# EAGLE design main (EAGLE 7.2.0)
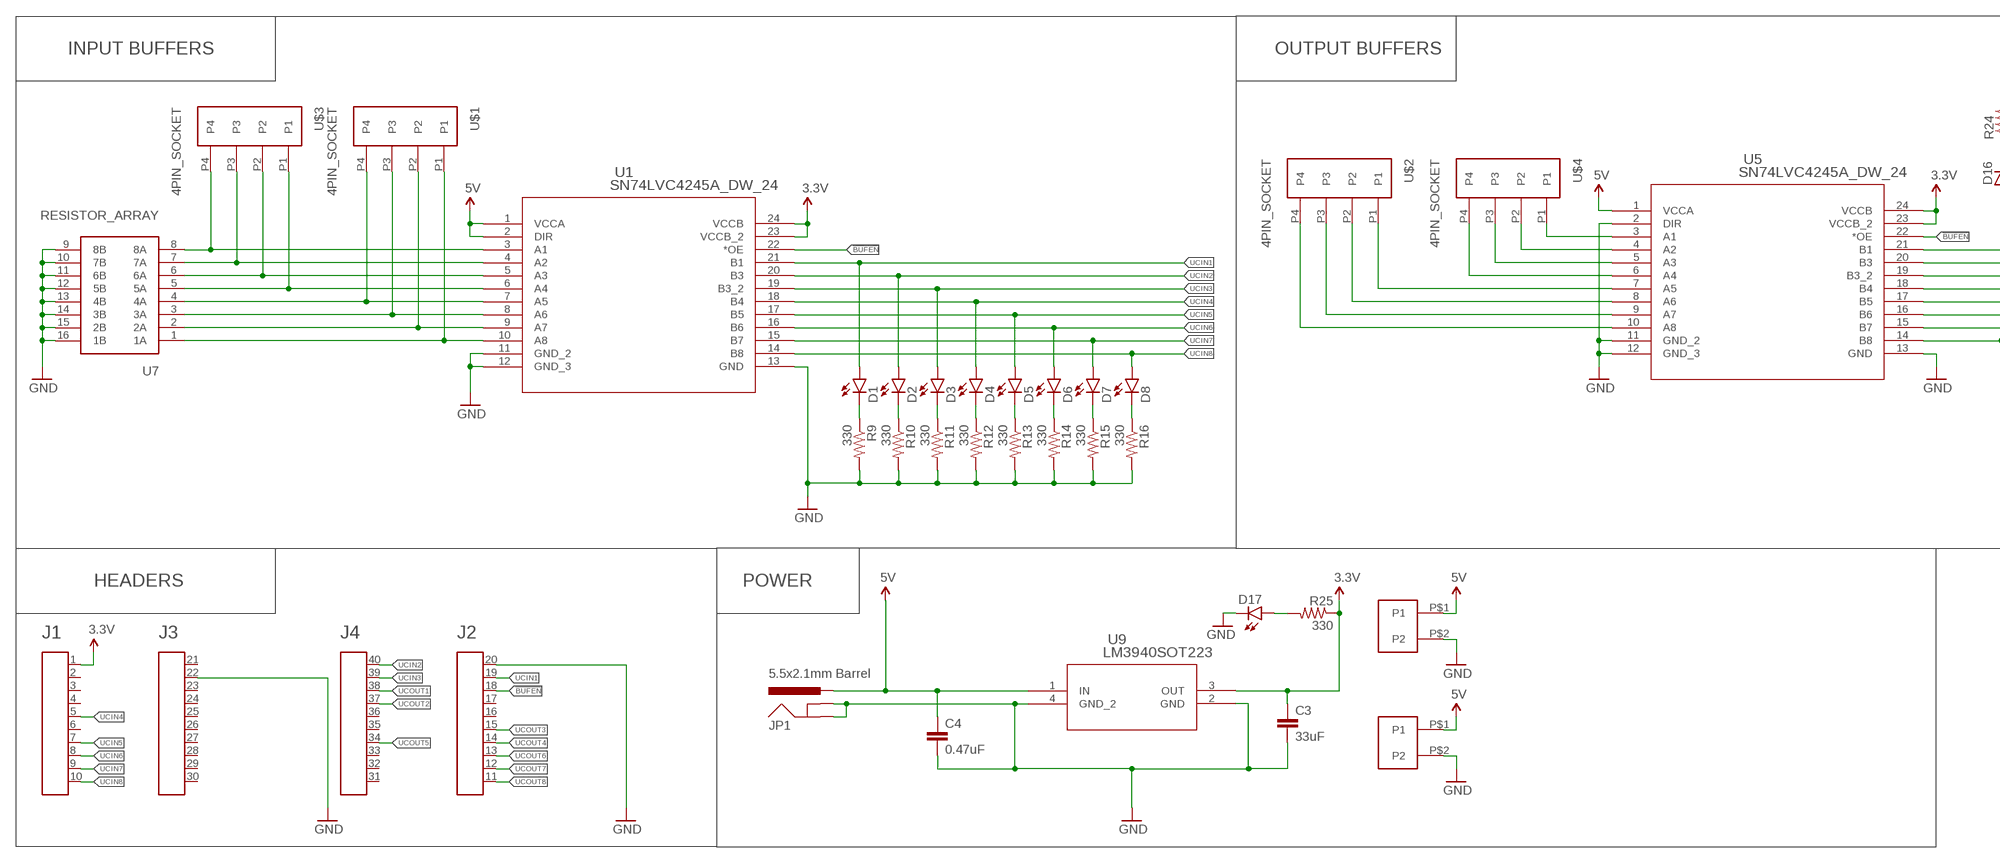
[diagram p0: schematic, sheet 1, part 1 of 2]
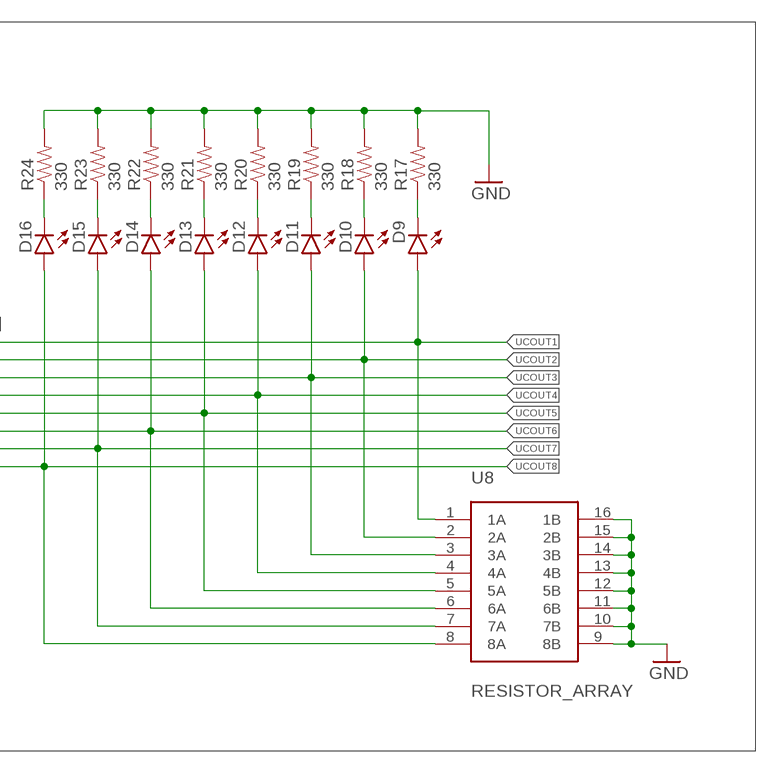
[diagram p1: schematic, sheet 1, part 2 of 2]

## Parts
A1  HEADER4X10-BOOSTERPACK  [4X10-BOOSTERPACK]
C3  33uF  2.2UF50V10%(1206)  [1206]
C4  0.47uF  1.0UF-25V-+80/-20(0805)  [0805]
D1  LED3MM  [LED3MM]
D2  LED3MM  [LED3MM]
D3  LED3MM  [LED3MM]
D4  LED3MM  [LED3MM]
D5  LED3MM  [LED3MM]
D6  LED3MM  [LED3MM]
D7  LED3MM  [LED3MM]
D8  LED3MM  [LED3MM]
D9  LED3MM  [LED3MM]
D10  LED3MM  [LED3MM]
D11  LED3MM  [LED3MM]
D12  LED3MM  [LED3MM]
D13  LED3MM  [LED3MM]
D14  LED3MM  [LED3MM]
D15  LED3MM  [LED3MM]
D16  LED3MM  [LED3MM]
D17  LED3MM  [LED3MM]
JP1  5.5x2.1mm Barrel  POWER_JACKSMD  [POWER_JACK_SMD]
R9  330  RESISTOR0805-RES  [0805]
R10  330  RESISTOR0805-RES  [0805]
R11  330  RESISTOR0805-RES  [0805]
R12  330  RESISTOR0805-RES  [0805]
R13  330  RESISTOR0805-RES  [0805]
R14  330  RESISTOR0805-RES  [0805]
R15  330  RESISTOR0805-RES  [0805]
R16  330  RESISTOR0805-RES  [0805]
R17  330  RESISTOR0805-RES  [0805]
R18  330  RESISTOR0805-RES  [0805]
R19  330  RESISTOR0805-RES  [0805]
R20  330  RESISTOR0805-RES  [0805]
R21  330  RESISTOR0805-RES  [0805]
R22  330  RESISTOR0805-RES  [0805]
R23  330  RESISTOR0805-RES  [0805]
R24  330  RESISTOR0805-RES  [0805]
R25  330  RESISTOR0805-RES  [0805]
U1  SN74LVC4245A_DW_24  [DW24]
U5  SN74LVC4245A_DW_24  [DW24]
U7  RESISTOR_ARRAY  [DIL16]
U8  RESISTOR_ARRAY  [DIL16]
U9  LM3940SOT223  [DCY]
U$1  4PIN_SOCKET  [CONN-4PIN]
U$2  4PIN_SOCKET  [CONN-4PIN]
U$3  4PIN_SOCKET  [CONN-4PIN]
U$4  4PIN_SOCKET  [CONN-4PIN]
U$5  2PIN_SOCKET  [CONN-2PIN]
U$6  2PIN_SOCKET  [CONN-2PIN]

## Nets
3.3V: A1.1 C3.1 R25.1 U1.23(VCCB_2) U1.24(VCCB) U5.23(VCCB_2) U5.24(VCCB) U9.3(OUT)
5V: C4.1 JP1.VIN0(PWR) U1.1(VCCA) U1.2(DIR) U5.1(VCCA) U9.1(IN) U$5.P$1(P1) U$6.P$1(P1)
!BUFEN!: A1.18 U1.22(*OE) U5.22(*OE)
GND: A1.20 A1.22 C3.2 C4.2 D17.K(C) JP1.GND(GNDBREAK) JP1.P$4(GND) R9.2 R10.2 R11.2 R12.2 R13.2 R14.2 R15.2 R16.2 R17.2 R18.2 R19.2 R20.2 R21.2 R22.2 R23.2 R24.2 U1.11(GND_2) U1.12(GND_3) U1.13(GND) U5.2(DIR) U5.11(GND_2) U5.12(GND_3) U5.13(GND) U7.9(8B) U7.10(7B) U7.11(6B) U7.12(5B) U7.13(4B) U7.14(3B) U7.15(2B) U7.16(1B) U8.9(8B) U8.10(7B) U8.11(6B) U8.12(5B) U8.13(4B) U8.14(3B) U8.15(2B) U8.16(1B) U9.2(GND) U9.4(GND_2) U$5.P$2(P2) U$6.P$2(P2)
N$1: U1.10(A8) U7.1(1A) U$1.P1
N$2: U1.9(A7) U7.2(2A) U$1.P2
N$3: U1.8(A6) U7.3(3A) U$1.P3
N$4: U1.7(A5) U7.4(4A) U$1.P4
N$5: U1.6(A4) U7.5(5A) U$3.P1
N$6: U1.5(A3) U7.6(6A) U$3.P2
N$7: U1.4(A2) U7.7(7A) U$3.P3
N$8: U1.3(A1) U7.8(8A) U$3.P4
N$9: D1.K(C) R9.1
N$10: D2.K(C) R10.1
N$11: D3.K(C) R11.1
N$12: D4.K(C) R12.1
N$13: D5.K(C) R13.1
N$14: D6.K(C) R14.1
N$15: D7.K(C) R15.1
N$16: D8.K(C) R16.1
N$17: U5.3(A1) U$4.P1
N$18: U5.4(A2) U$4.P2
N$19: U5.5(A3) U$4.P3
N$20: U5.6(A4) U$4.P4
N$21: U5.7(A5) U$2.P1
N$22: U5.8(A6) U$2.P2
N$23: U5.9(A7) U$2.P3
N$24: U5.10(A8) U$2.P4
N$25: D9.K(C) R17.1
N$26: D10.K(C) R18.1
N$27: D11.K(C) R19.1
N$28: D12.K(C) R20.1
N$29: D13.K(C) R21.1
N$30: D14.K(C) R22.1
N$31: D15.K(C) R23.1
N$32: D16.K(C) R24.1
N$33: D17.A R25.2
UCIN1: A1.19 D1.A U1.21(B1)
UCIN2: A1.40 D2.A U1.20(B3)
UCIN3: A1.39 D3.A U1.19(B3_2)
UCIN4: A1.5 D4.A U1.18(B4)
UCIN5: A1.7 D5.A U1.17(B5)
UCIN6: A1.8 D6.A U1.16(B6)
UCIN7: A1.9 D7.A U1.15(B7)
UCIN8: A1.10 D8.A U1.14(B8)
UCOUT1: A1.38 D9.A U5.21(B1) U8.1(1A)
UCOUT2: A1.37 D10.A U5.20(B3) U8.2(2A)
UCOUT3: A1.15 D11.A U5.19(B3_2) U8.3(3A)
UCOUT4: A1.14 D12.A U5.18(B4) U8.4(4A)
UCOUT5: A1.34 D13.A U5.17(B5) U8.5(5A)
UCOUT6: A1.13 D14.A U5.16(B6) U8.6(6A)
UCOUT7: A1.12 D15.A U5.15(B7) U8.7(7A)
UCOUT8: A1.11 D16.A U5.14(B8) U8.8(8A)
Unconnected: A1.2 A1.3 A1.4 A1.6 A1.16 A1.17 A1.21 A1.23 A1.24 A1.25 A1.26 A1.27 A1.28 A1.29 A1.30 A1.31 A1.32 A1.33 A1.35 A1.36

## Notes on the sheet
- INPUT BUFFERS | OUTPUT BUFFERS
- HEADERS | POWER

## Library data of the parts
A1 = EAGLE_BoosterPack_Library:HEADER4X10-BOOSTERPACK
C3 = SparkFun-Capacitors:2.2UF50V10%(1206): CAP-10009; PROD_ID: CAP-10009; VALUE: 2.2UF
C4 = SparkFun-Capacitors:1.0UF-25V-+80/-20(0805): CAP-11625; PROD_ID: CAP-11625; VALUE: 1.0uF
D1-D17 = SparkFun-LED:LED: LEDs Standard schematic elements and footprints for 5mm, 3mm, 1206, and 0603 sized LEDs. 5mm - Spark Fun Electronics SKU : COM-00529 (and others)
JP1 = SparkFun-Connectors:POWER_JACK: Power Jack This is the standard 5.5mm barrel jack for power. The PTH is the most common, proven, reliable, footprint. The Slot footprint only works if the mill layer is transmitted to the PCB fab house so be warned. Mating wall wart : TOL-00298 (and others); PROD_ID: CONN-08106
R9-R25 = SparkFun-Resistors:RESISTOR: Resistor Basic schematic elements and footprints for 0603, 1206, and PTH resistors.
U1 U5 = ControllerCard:SN74LVC4245A_DW_24; DATASHEETURL: http://www.ti.com/lit/gpn/SN74LVC4245A; DESCRIPTION: Octal Bus Transceiver And 3.3-V To 5-V Shifter With 3-State Outputs; FAMILY_NAME: DIRECTION CONTROL DUAL SUPPLY TRANSLATOR; GENERIC_PART_NUMBER: SN74LVC4245A; INDUSTRY_STD_PKG_TYPE: SOIC; MANUFACTURER: Texas Instruments; MANUFACTURER_PART_NUMBER: sn74lvc4245a_dw_24; PACKAGE_DESIGNATOR: DW; PIN_COUNT: 24; VENDOR: Texas Instruments
U7 U8 = ControllerCard:RESISTOR_ARRAY
U9 = ControllerCard:LM3940
U$1-U$4 = ControllerCard:4PIN_SOCKET
U$5 U$6 = ControllerCard:2PIN_SOCKET

## Board
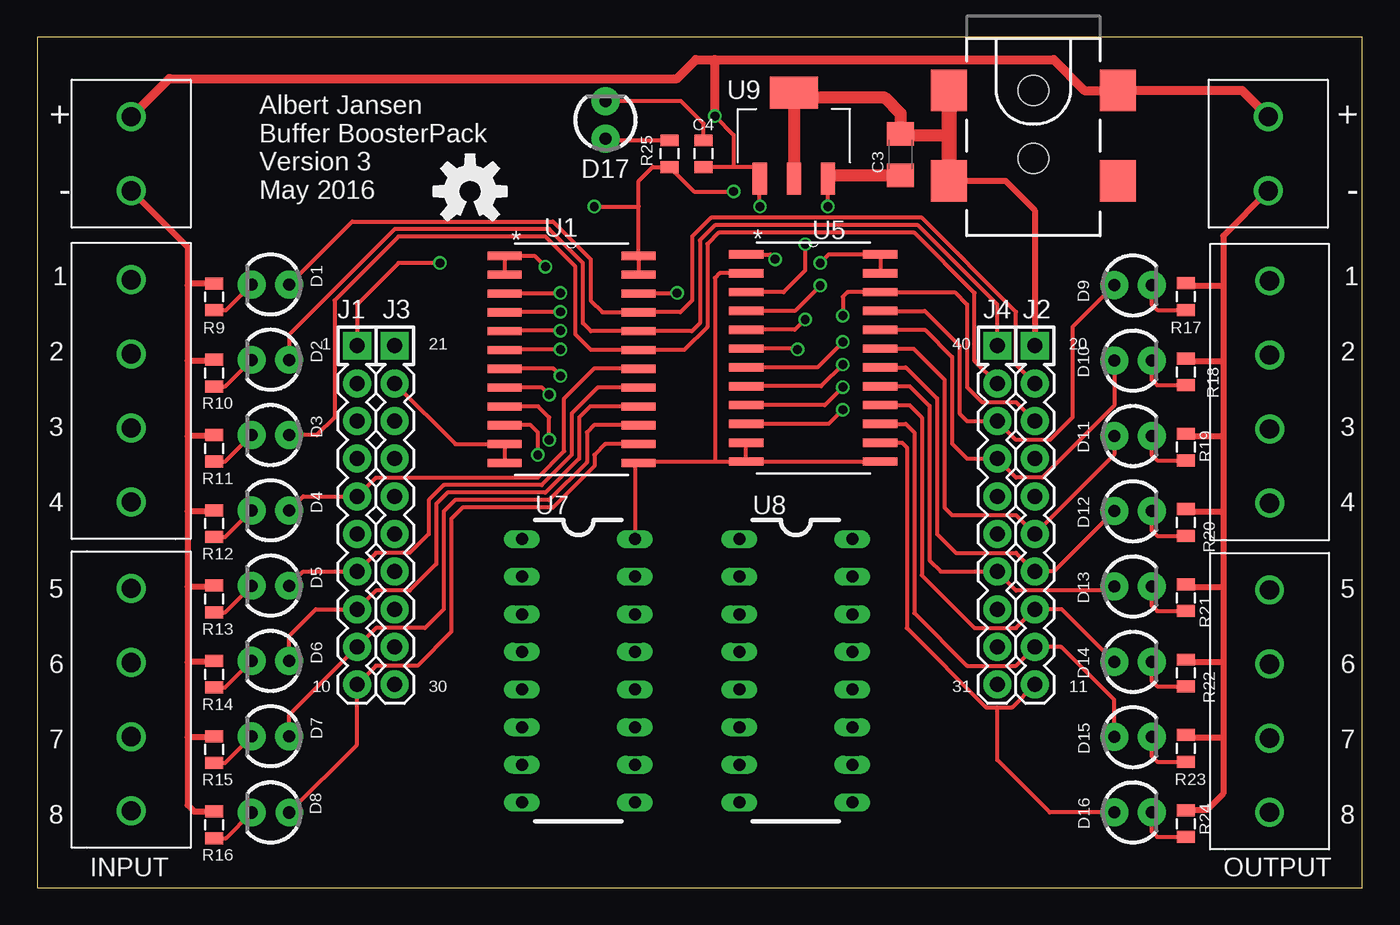
[diagram p2: board, top side]
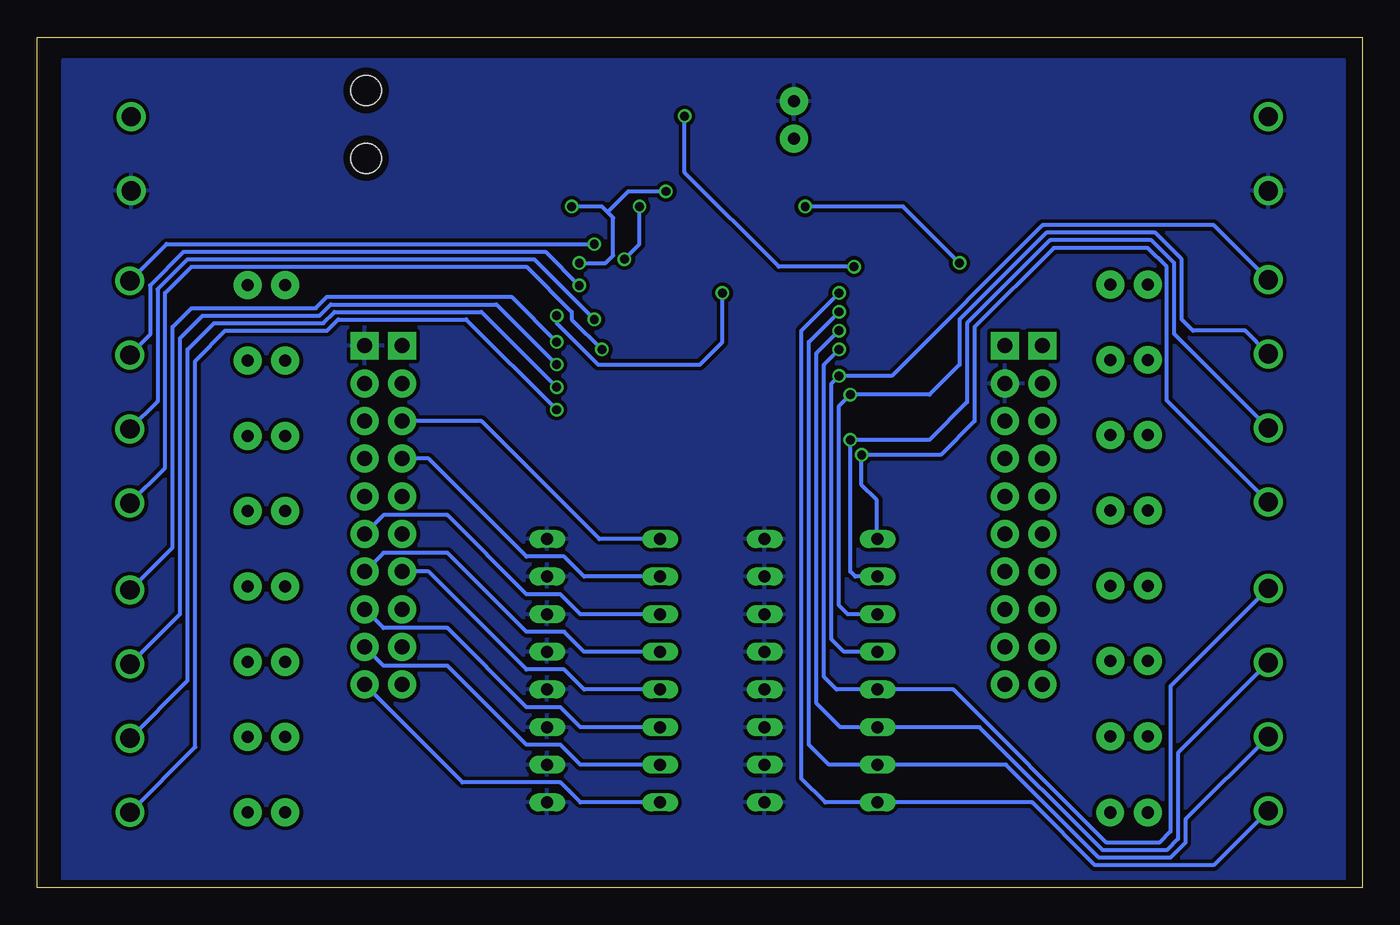
[diagram p3: board, bottom side, seen from below]

Size 89.41 x 57.4 mm. Coordinates in mm from the lower left corner, seen from the top.
Outline: 0,0 89.41,0 89.41,57.4 0,57.4 0,0
Copper layers (1*16): Top 0.035mm / dielectric 1.6mm / Bottom 0.035mm
Design rules "Elecrow_2-layer_PCB_eagle_rule": minimum track width 6mil, minimum drill 12mil, track to track 6mil, track to pad 6mil, pad to pad 6mil, via to via 8mil, smd to smd 0mil, copper to edge 20mil, drill to drill 10mil, minimum pad ring 6mil, minimum via ring 6mil, stop-mask expansion 0mil, vias tented up to drill 100mil, thermal gap 10mil

### Footprints (pad centres in the part's own frame; a part is rotated, then mirrored left to right if it is on the bottom)
4X10-BOOSTERPACK = drill 1.016 pad 1.88 square: 1 0,10.16; 20 45.72,10.16; 21 2.54,10.16; 40 43.18,10.16 | drill 1.016 pad 1.88: 2 0,7.62; 3 0,5.08; 4 0,2.54; 5 0,0; 6 0,-2.54; 7 0,-5.08; 8 0,-7.62; 9 0,-10.16; 10 0,-12.7; 11 45.72,-12.7; 12 45.72,-10.16; 13 45.72,-7.62; 14 45.72,-5.08; 15 45.72,-2.54; 16 45.72,0; 17 45.72,2.54; 18 45.72,5.08; 19 45.72,7.62; 22 2.54,7.62; 23 2.54,5.08; 24 2.54,2.54; 25 2.54,0; 26 2.54,-2.54; 27 2.54,-5.08; 28 2.54,-7.62; 29 2.54,-10.16; 30 2.54,-12.7; 31 43.18,-12.7; 32 43.18,-10.16; 33 43.18,-7.62; 34 43.18,-5.08; 35 43.18,-2.54; 36 43.18,0; 37 43.18,2.54; 38 43.18,5.08; 39 43.18,7.62
1206 = smd 1.6 x 1.8: 1 -1.4,0; 2 1.4,0
0805 = smd 0.8 x 1.2: 1 -0.9,0; 2 0.9,0
LED3MM = drill 0.813 pad 1.88: A -1.27,0; K 1.27,0
POWER_JACK_SMD = smd 2.8 x 2.4: GND 0,-5.7; P$4 6.1,-5.7; VIN0 0,5.7; VIN1 6.1,5.7 | hole 2.032: 0,0; 4.572,0
DW24 = smd 2.311 x 0.559: 1 -4.521,6.985; 2 -4.521,5.715; 3 -4.521,4.445; 4 -4.521,3.175; 5 -4.521,1.905; 6 -4.521,0.635; 7 -4.521,-0.635; 8 -4.521,-1.905; 9 -4.521,-3.175; 10 -4.521,-4.445; 11 -4.521,-5.715; 12 -4.521,-6.985; 13 4.521,-6.985; 14 4.521,-5.715; 15 4.521,-4.445; 16 4.521,-3.175; 17 4.521,-1.905; 18 4.521,-0.635; 19 4.521,0.635; 20 4.521,1.905; 21 4.521,3.175; 22 4.521,4.445; 23 4.521,5.715; 24 4.521,6.985
DIL16 = drill 0.813 long: 1 -8.89,-3.81; 2 -6.35,-3.81; 3 -3.81,-3.81; 4 -1.27,-3.81; 5 1.27,-3.81; 6 3.81,-3.81; 7 6.35,-3.81; 8 8.89,-3.81; 9 8.89,3.81; 10 6.35,3.81; 11 3.81,3.81; 12 1.27,3.81; 13 -1.27,3.81; 14 -3.81,3.81; 15 -6.35,3.81; 16 -8.89,3.81
DCY = smd 0.95 x 2.15: 1 -2.3,-2.9; 2 0,-2.9; 3 2.3,-2.9 | smd 3.25 x 2.15: 4 0,2.9
CONN-4PIN = drill 1.3: P1 -7.5,0; P2 -2.5,0; P3 2.5,0; P4 7.5,0
CONN-2PIN = drill 1.3: P$1 -2.5,0; P$2 2.5,0

### Placement (x,y rotation side)
A1  21.59,26.42 0 top
C3  58.24,49.47 90 top
C4  44.96,49.53 90 top
D1  15.74,40.7 180 top
D2  15.74,35.62 180 top
D3  15.74,30.54 180 top
D4  15.74,25.46 180 top
D5  15.74,20.38 180 top
D6  15.74,15.3 180 top
D7  15.74,10.22 180 top
D8  15.75,5.08 180 top
D9  73.93,40.66 0 top
D10  73.93,35.58 0 top
D11  73.93,30.5 0 top
D12  73.93,25.42 0 top
D13  73.93,20.34 0 top
D14  73.93,15.26 0 top
D15  73.93,10.18 0 top
D16  73.93,5.1 0 top
D17  38.35,51.82 90 top
JP1  67.21,53.8 270 top
R9  11.94,39.88 90 top
R10  11.94,34.73 90 top
R11  11.94,29.65 90 top
R12  11.94,24.57 90 top
R13  11.94,19.49 90 top
R14  11.94,14.41 90 top
R15  11.94,9.33 90 top
R16  11.94,4.25 90 top
R17  77.49,39.89 90 top
R18  77.49,34.81 90 top
R19  77.49,29.73 90 top
R20  77.49,24.65 90 top
R21  77.49,19.57 90 top
R22  77.49,14.49 90 top
R23  77.49,9.41 90 top
R24  77.49,4.33 90 top
R25  42.67,49.53 90 top
U1  36.06,35.66 0 top
U5  52.36,35.75 0 top
U7  36.52,14.65 270 top
U8  51.19,14.65 270 top
U9  51.05,50.74 0 top
U$1  6.35,33.53 90 top
U$2  83.14,12.6 270 top
U$3  6.35,12.7 270 top
U$4  83.15,33.45 270 top
U$5  6.35,49.53 270 top
U$6  83.06,49.53 270 top
U$7  [OSHW-LOGO-M]  29.21,46.99 0 top

### Tracks (layer width: path | path; a pad name or v marks a point on that pad's centre or on a via)
3.3V  (via drill 0.6)
  Top 0.254: U1.23 U1.24 40.58,45.97 | U5.23 U5.24 53.4,42.73 v52.83,42.16 | 40.58,45.97 40.58,47.69 41.52,48.63 R25.1 44.31,46.99 v46.99,46.99 | v53.34,45.97 U9.3 | v37.59,45.97 40.58,45.97 | v27.18,42.16 24.38,42.16 21.59,39.37 A1.1
  Top 0.813: U9.3 53.58,48.07 C3.1
  Bottom 0.254: v52.83,42.16 51.05,42.16 50.55,42.67 50.55,45.21 50.93,45.59 | 50.93,45.59 51.31,45.97 v53.34,45.97 | v27.18,42.16 30.99,45.97 v37.59,45.97 | v46.99,46.99 49.53,46.99 50.93,45.59
5V  (via drill 0.6)
  Top 0.254: U1.2 U1.1 33.56,42.64 v34.29,41.91 | 46.99,48.63 48.75,48.63 U9.1 48.75,46.25 v48.77,45.97 | 46.99,48.63 C4.1 | v45.72,52.07 46.99,50.8 46.99,48.63 | U5.1 49.47,42.73 v49.78,42.42
  Top 0.61: U$6.P$1 81.29,53.8 JP1.VIN0 70.66,53.8 68.58,55.88 45.72,55.88 | U$5.P$1 8.93,54.61 43.18,54.61 44.45,55.88 45.72,55.88 | v45.72,52.07 45.72,55.88
  Top 0.813: JP1.VIN0 72.86,53.85
  Bottom 0.254: v34.29,41.91 39.37,41.91 45.72,48.26 v45.72,52.07 | v49.78,42.42 48.77,43.43 v48.77,45.97
!BUFEN!  (via drill 0.6)
  Top 0.254: A1.18 66.04,32.77 63.75,32.77 62.74,33.78 62.74,39.37 61.91,40.2 U5.22 54.67,40.2 54.36,39.88 v54.36,38.61 | v43.18,40.13 43.15,40.1 U1.22
  Bottom 0.254: v54.36,38.61 54.36,38.1 51.56,35.31 44.7,35.31 43.18,36.83 v43.18,40.13
GND
  Top 0.254: A1.22 28.23,29.94 U1.11 U1.12 | U5.12 U5.11 | 45.72,28.77 40.67,28.77 U1.13 40.33,28.42 U7.16 | 45.72,28.77 U5.12 | U5.12 U5.13 | C4.2 44.96,51.56 43.43,53.09 D17.K | U5.2 46.04,41.47 45.72,41.15 45.72,28.77
  Top 0.406: U$5.P$2 10.16,43.22 10.16,40.64 | 10.16,40.64 10.16,35.56 | 10.16,35.56 10.16,30.48 | 10.16,30.48 10.16,25.4 | 10.16,25.4 10.16,20.32 | 10.16,20.32 10.16,15.24 | 10.16,15.24 10.16,10.16 | 10.16,10.16 10.16,5.59 10.59,5.15 R16.2 | R15.2 11.87,10.16 10.16,10.16 | R14.2 11.87,15.24 10.16,15.24 | R13.2 11.87,20.32 10.16,20.32 | R12.2 11.87,25.4 10.16,25.4 | R11.2 11.87,30.48 10.16,30.48 | R10.2 11.87,35.56 10.16,35.56 | R9.2 10.3,40.78 arc90 10.16,40.64 | U$6.P$2 80.01,43.98 80.01,40.64 | 80.01,40.64 80.01,35.56 | 80.01,35.56 80.01,30.48 | 80.01,30.48 80.01,25.4 | 80.01,25.4 80.01,20.32 | 80.01,20.32 80.01,15.24 | 80.01,15.24 80.01,10.16 | 80.01,10.16 80.01,6.35 78.89,5.23 R24.2 | R23.2 77.64,10.16 80.01,10.16 | R22.2 77.64,15.24 80.01,15.24 | R21.2 77.64,20.32 80.01,20.32 | R20.2 77.64,25.4 80.01,25.4 | R19.2 77.64,30.48 80.01,30.48 | R18.2 77.64,35.56 80.01,35.56 | R17.2 77.64,40.64 80.01,40.64 | JP1.P$4 65.33,47.7 67.31,45.72 A1.20
  Top 0.813: 61.51,50.8 58.32,50.8 C3.2 58.24,52.25 57.15,53.34 51.35,53.34 U9.4 U9.2
  Top 1.016: JP1.GND 61.51,50.8 JP1.P$4
  pour Bottom (isolate 0.254): 1.27,55.88 1.27,0.51 87.63,0.51 87.63,55.88
N$1  (via drill 0.6)
  Top 0.254: v33.78,29.21 33.78,30.73 33.3,31.21 U1.10
  Bottom 0.254: U7.1 32.77,23.6 32.77,26.16 33.78,27.18 v33.78,29.21 28.45,29.21 26.16,31.5 26.16,37.85 20.83,43.18 14.48,43.18 13.21,41.91 13.21,32.89 U$1.P1
N$2  (via drill 0.6)
  Top 0.254: v34.54,30.23 34.54,31.75 33.81,32.48 U1.9
  Bottom 0.254: U7.2 34.21,21 34.54,21.34 v34.54,30.23 29.21,30.23 26.67,32.77 26.67,38.1 21.08,43.69 14.22,43.69 12.7,42.16 12.7,37.38 U$1.P2
N$3  (via drill 0.6)
  Top 0.254: v34.54,33.27 34.07,33.75 U1.8
  Bottom 0.254: U7.3 34.72,18.46 35.31,19.05 35.31,32.51 v34.54,33.27 29.21,33.27 27.18,35.31 27.18,38.35 21.34,44.2 13.97,44.2 12.19,42.42 12.19,38.35 11.43,37.59 7.91,37.59 U$1.P3
N$4  (via drill 0.6)
  Top 0.254: v35.31,34.54 34.83,35.02 U1.7
  Bottom 0.254: U7.4 34.97,15.92 35.81,16.76 35.81,34.04 v35.31,34.54 31.75,34.54 21.59,44.7 10.03,44.7 U$1.P4
N$5  (via drill 0.6)
  Top 0.254: v35.31,36.32 31.57,36.32 U1.6
  Bottom 0.254: v35.31,36.32 36.32,35.31 36.32,14.22 35.48,13.38 U7.5 27.6,13.38 17.27,3.05 13.72,3.05 12.95,3.81 12.95,13.6 U$3.P1
N$6  (via drill 0.6)
  Top 0.254: v35.31,37.59 31.57,37.59 U1.5
  Bottom 0.254: v35.31,37.59 36.83,36.07 36.83,12.45 35.22,10.84 U7.6 25.83,10.84 17.53,2.54 13.21,2.54 12.45,3.3 12.45,9.1 U$3.P2
N$7  (via drill 0.6)
  Top 0.254: v35.31,38.86 35.27,38.83 U1.4
  Bottom 0.254: v35.31,38.86 37.34,36.83 37.34,9.65 35.99,8.3 U7.7 24.05,8.3 17.78,2.03 12.95,2.03 11.94,3.05 11.94,4.61 U$3.P3
N$8  (via drill 0.6)
  Top 0.254: v35.31,40.13 35.27,40.1 U1.3
  Bottom 0.254: v35.31,40.13 37.85,37.59 37.85,7.37 36.24,5.76 U7.8 22.27,5.76 18.03,1.52 10.03,1.52 U$3.P4
N$9
  Top 0.254: R9.1 12.75,38.98 D1.K
N$10
  Top 0.254: R10.1 12.68,33.83 D2.K
N$11
  Top 0.254: R11.1 12.68,28.75 D3.K
N$12
  Top 0.254: R12.1 12.68,23.67 D4.K
N$13
  Top 0.254: R13.1 12.68,18.59 D5.K
N$14
  Top 0.254: R14.1 12.68,13.51 D6.K
N$15
  Top 0.254: R15.1 12.68,8.43 D7.K
N$16
  Top 0.254: R16.1 12.75,3.35 D8.K
N$17  (via drill 0.6)
  Top 0.254: v51.82,43.43 51.82,41.66 50.35,40.2 U5.3
  Bottom 0.254: v51.82,43.43 80.67,43.43 U$4.P1
N$18  (via drill 0.6)
  Top 0.254: v52.83,40.64 51.12,38.92 U5.4
  Bottom 0.254: v52.83,40.64 55.12,42.93 79.5,42.93 81.79,40.64 81.79,37.32 U$4.P2
N$19  (via drill 0.6)
  Top 0.254: v51.82,38.35 51.12,37.66 U5.5
  Bottom 0.254: v51.82,38.35 55.88,42.42 79.25,42.42 81.28,40.39 81.28,32.82 U$4.P3
N$20  (via drill 0.6)
  Top 0.254: v51.31,36.32 51.24,36.38 U5.6
  Bottom 0.254: U$4.P4 80.77,28.33 80.77,40.13 78.99,41.91 56.39,41.91 53.34,38.86 53.34,38.35 v51.31,36.32
N$21  (via drill 0.6)
  Top 0.254: v54.36,36.83 52.64,35.12 U5.7
  Bottom 0.254: U$2.P1 80.26,22.97 80.26,37.85 78.99,39.12 70.61,39.12 69.85,39.88 57.4,39.88 v54.36,36.83
N$22  (via drill 0.6)
  Top 0.254: v54.36,35.31 52.9,33.84 U5.8
  Bottom 0.254: U$2.P2 79.76,18.48 79.76,37.08 78.23,38.61 70.36,38.61 69.6,39.37 58.42,39.37 v54.36,35.31
N$23  (via drill 0.6)
  Top 0.254: v54.36,33.78 53.15,32.58 U5.9
  Bottom 0.254: U$2.P3 79.25,13.99 79.25,36.32 77.47,38.1 70.1,38.1 69.34,38.86 59.44,38.86 v54.36,33.78
N$24  (via drill 0.6)
  Top 0.254: v54.36,32.26 53.4,31.3 U5.10
  Bottom 0.254: U$2.P4 78.74,9.5 78.74,35.56 76.71,37.59 69.85,37.59 69.09,38.35 60.45,38.35 v54.36,32.26
N$25
  Top 0.254: D9.K 75.18,40.64 75.18,39.37 75.56,38.99 R17.1
N$26
  Top 0.254: D10.K 75.18,35.56 75.18,34.29 75.56,33.91 R18.1
N$27
  Top 0.254: D11.K 75.18,30.48 75.18,29.21 75.56,28.83 R19.1
N$28
  Top 0.254: D12.K 75.18,25.4 75.18,24.13 75.56,23.75 R20.1
N$29
  Top 0.254: D13.K 75.18,20.32 75.18,19.05 75.56,18.67 R21.1
N$30
  Top 0.254: D14.K 75.18,15.24 75.18,13.97 75.56,13.59 R22.1
N$31
  Top 0.254: D15.K 75.18,10.16 75.18,8.89 75.56,8.51 R23.1
N$32
  Top 0.254: D16.K 75.18,5.08 75.18,3.81 75.56,3.43 R24.1
N$33
  Top 0.254: D17.A 38.47,50.43 R25.2
UCIN1
  Top 0.254: A1.19 66.04,35.31 66.04,38.86 59.69,45.21 45.47,45.21 44.2,43.94 44.2,39.62 43.4,38.83 U1.21 38.13,38.83 37.34,39.62 37.34,42.42 34.8,44.96 21.27,44.96 D1.A
UCIN2
  Top 0.254: A1.40 64.77,39.37 59.44,44.7 45.72,44.7 44.7,43.69 44.7,38.1 44.16,37.56 U1.20 37.37,37.56 36.83,38.1 36.83,42.16 34.54,44.45 24.13,44.45 17.01,37.33 D2.A
UCIN3
  Top 0.254: A1.39 63.25,35.56 63.25,40.13 59.18,44.2 45.97,44.2 45.21,43.43 45.21,37.85 43.66,36.29 U1.19 37.37,36.29 36.32,37.34 36.32,41.91 34.29,43.94 24.38,43.94 20.07,39.62 20.07,31.75 18.86,30.54 D3.A
UCIN4
  Top 0.254: U1.18 37.56,35.02 35.56,33.02 35.56,29.46 33.78,27.69 22.86,27.69 A1.5 17.97,26.42 D4.A
UCIN5
  Top 0.254: U1.17 37.81,33.75 36.07,32 36.07,29.21 34.04,27.18 27.43,27.18 26.42,26.16 26.42,23.88 25.15,22.61 22.86,22.61 A1.7 17.97,21.34 D5.A
UCIN6
  Top 0.254: U1.16 37.31,32.48 36.58,31.75 36.58,28.96 34.29,26.67 27.69,26.67 26.92,25.91 26.92,21.84 25.15,20.07 22.86,20.07 A1.8 18.8,18.8 17.01,17.01 D6.A
UCIN7
  Top 0.254: U1.15 37.56,31.21 37.08,30.73 37.08,28.7 34.54,26.16 28.19,26.16 27.43,25.4 27.43,18.8 26.16,17.53 22.86,17.53 A1.9 | 21.59,16.07 A1.9 | D7.A 17.01,11.68 A1.9
UCIN8
  Top 0.254: U1.14 38.32,29.94 37.59,29.21 37.59,28.45 34.8,25.65 28.7,25.65 27.94,24.89 27.94,17.27 25.65,14.99 22.86,14.99 A1.10 21.59,9.65 D8.A
UCOUT1
  Top 0.254: U5.21 59.88,38.92 62.23,36.58 62.23,32 62.74,31.5 A1.38 66.04,30.23 68.33,30.23 69.85,31.75 69.85,37.85 D9.A
  Bottom 0.254: U8.1 51.48,23.54 59.44,31.5 A1.38
UCOUT2
  Top 0.254: U5.20 59.88,37.66 61.72,35.81 61.72,29.97 62.74,28.96 A1.37 66.04,27.69 67.82,27.69 72.66,32.53 D10.A
  Bottom 0.254: U8.2 52.5,21 53.85,22.35 56.39,22.35 62.99,28.96 A1.37
UCOUT3
  Top 0.254: U5.19 59.12,36.38 61.21,34.29 61.21,25.65 61.72,25.15 66.04,25.15 A1.15 72.66,29.23 D11.A
  Bottom 0.254: U8.3 52.75,18.46 54.1,19.81 56.39,19.81 61.72,25.15 66.04,25.15 A1.15
UCOUT4
  Top 0.254: U5.18 58.61,35.12 60.71,33.02 60.71,23.88 61.98,22.61 66.04,22.61 A1.14 68.58,21.34 D12.A
  Bottom 0.254: U8.4 52.5,15.92 53.85,17.27 56.39,17.27 61.72,22.61 66.04,22.61 A1.14
UCOUT5
  Top 0.254: U5.17 58.87,33.84 60.2,32.51 60.2,22.1 60.96,21.34 A1.34 66.04,20.07 72.39,20.07 D13.A
  Bottom 0.254: U8.5 52.5,13.38 53.85,14.73 56.39,14.73 62.99,21.34 A1.34
UCOUT6
  Top 0.254: U5.16 58.87,32.58 59.69,31.75 59.69,21.08 63.25,17.53 66.04,17.53 A1.13 69.12,18.8 D14.A
  Bottom 0.254: U8.6 52.75,10.84 54.1,12.19 56.39,12.19 61.72,17.53 66.04,17.53 A1.13
UCOUT7
  Top 0.254: U5.15 58.61,31.3 59.18,30.73 59.18,18.54 62.74,14.99 66.04,14.99 A1.12 69.09,16.26 72.66,12.68 D15.A
  Bottom 0.254: U8.7 52.75,8.3 54.1,9.65 56.39,9.65 61.72,14.99 66.04,14.99 A1.12
UCOUT8
  Top 0.254: U5.14 58.36,30.04 58.67,29.72 58.67,17.53 64.01,12.19 64.77,12.19 | 64.77,12.19 65.79,12.19 A1.11 | D16.A 68.31,5.1 64.77,8.64 64.77,12.19
  Bottom 0.254: U8.8 52.75,5.76 54.1,7.11 60.71,7.11 A1.11

### Text on the board
tPlace: + | + | - | - | 1 | 1 | 2 | 2 | 3 | 3 | 4 | 4 | 5 | 5 | 6 | 6 | 7 | 7 | 8 | 8 | INPUT | OUTPUT
tNames: Albert Jansen / Buffer BoosterPack / Version 3 / May 2016